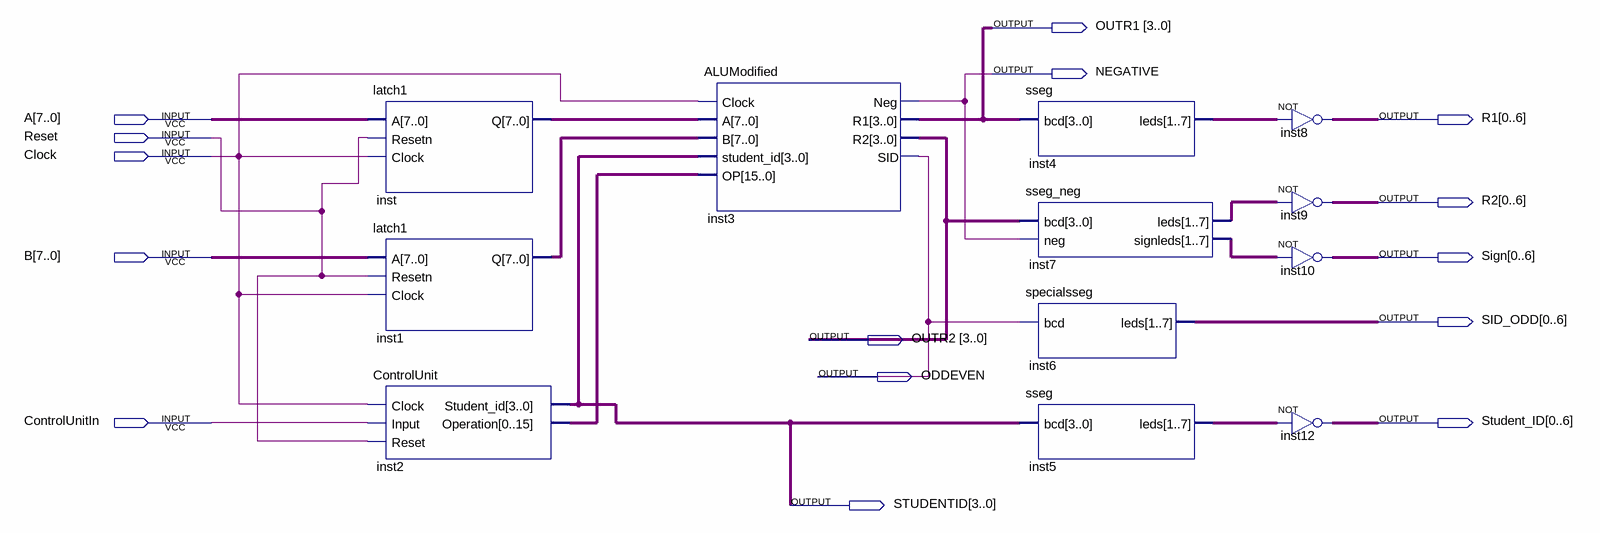
[diagram p0: schematic sheet]
// Quartus schematic ModifiedControlUnit.bdf as structural Verilog: 12 symbols, 15 pins
module ModifiedControlUnit (
  input  [7:0] A,
  input  Reset,
  input  Clock,
  input  [7:0] B,
  input  ControlUnitIn,
  output [3:0] OUTR1,
  output NEGATIVE,
  output [0:6] R1,
  output [0:6] R2,
  output [0:6] Sign,
  output [0:6] SID_ODD,
  output [3:0] OUTR2,
  output ODDEVEN,
  output [0:6] Student_ID,
  output [3:0] STUDENTID
);

  wire [6:0] inst4_leds, inst5_leds, inst7_leds, inst7_signleds;
  wire [7:0] inst1_q, inst_q;
  wire [15:0] inst2_operation;

  latch1 inst (.A(A), .Resetn(Reset), .Clock(Clock), .Q(inst_q));
  latch1 inst1 (.A(B), .Resetn(Reset), .Clock(Clock), .Q(inst1_q));
  ControlUnit inst2 (
    .Clock(Clock), .Input(ControlUnitIn), .Reset(Reset), .Student_id(STUDENTID), .Operation(inst2_operation));
  ALUModified inst3 (
    .Clock(Clock), .A(inst_q), .B(inst1_q), .student_id(STUDENTID), .OP(inst2_operation), .Neg(NEGATIVE),
    .R1(OUTR1), .R2(OUTR2), .SID(ODDEVEN));
  sseg inst4 (.bcd(OUTR1), .leds(inst4_leds));
  sseg_neg inst7 (.bcd(OUTR2), .neg(NEGATIVE), .leds(inst7_leds), .signleds(inst7_signleds));
  specialsseg inst6 (.bcd(ODDEVEN), .leds(SID_ODD));
  sseg inst5 (.bcd(STUDENTID), .leds(inst5_leds));
  assign R1 = ~inst4_leds;  // NOT inst8, 7 bits wide
  assign R2 = ~inst7_leds;  // NOT inst9, 7 bits wide
  assign Sign = ~inst7_signleds;  // NOT inst10, 7 bits wide
  assign Student_ID = ~inst5_leds;  // NOT inst12, 7 bits wide
endmodule
